# Altium schematic sheet Accelerometer.SchDoc: Accelerometer
size A; Author: Zac Carico; CompanyName: BYUI; DrawnBy: Zac Carico; Engineer: Zac Carico; Organization: CSEE; DocumentNumber: 12; Revision: 0.0.1; SheetNumber: 12; SheetTotal: 15
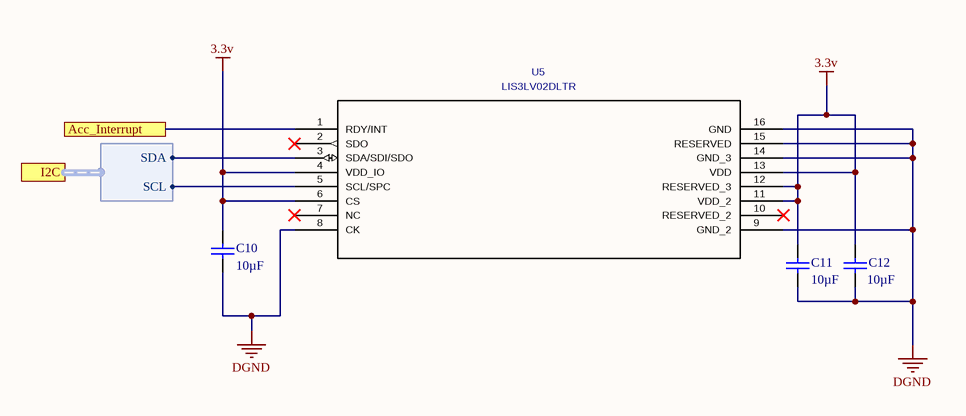
[diagram p0: Accelerometer.SchDoc]

## Parts
C10  Capacitance: 10µF  [CAPC1608X90X20LL10]  (hidden comment: C1608X5R1A106K080AC)
C11  Capacitance: 10µF  [CAPC1608X90X20LL10]  (hidden comment: C1608X5R1A106K080AC)
C12  Capacitance: 10µF  [CAPC1608X90X20LL10]  (hidden comment: C1608X5R1A106K080AC)
U5  LIS3LV02DLTR  [LGA-16_4P4X7P5X1]

## Ports
Acc_Interrupt, I2C (harness I2C)

## Harnesses
I2C: SCL, SDA

## Nets
3.3v: C10.2 C11.2 C12.2 U5.4(VDD_IO) U5.6(CS) U5.11(VDD_2) U5.12(RESERVED_3) U5.13(VDD)
DGND: C10.1 C11.1 C12.1 U5.8(CK) U5.9(GND_2) U5.14(GND_3) U5.15(RESERVED) U5.16(GND)
Acc_Interrupt: U5.1(RDY/INT) ; port Acc_Interrupt
NetU5_3: U5.3(SDA/SDI/SDO) ; port I2C.SDA
NetU5_5: U5.5(SCL/SPC) ; port I2C.SCL

Not connected (* = marked no-connect by the designer): U5 2(SDO)* 7(NC)* 10(RESERVED_2)*

## Library data of the parts
C10-C12 = CMP-2000-04979-1: Chip Capacitor, 10 uF, +/- 10%, 10 V, -55 to 85 degC, 0603 (1608 Metric), RoHS, Tape and Reel; PCN Part Number: MLCCPartNumberChange30/Nov/2012; Manufacturer: TDK; Temperature Coefficient: X5R; Product Training Modules: CSeriesGeneralApplicationsSEAT,CCV,andTVCLDesignToolsGuidetoReplacinganElectrolyticCapacitorwithanMLCC; Online Catalog: CSeries,GeneralPurpose; Voltage - Rated: 10V; Other Names: 445-7486-1; Design Resources: 20WNon-IsolatedBuckLEDDriverUsingPLLNK460KG; Kits: 445-9003-KIT-ND-KITCAPCERHICAPMLCCSMD; Height - Seated (Max): -; Family: CeramicCapacitors; Package Description: 2-Pin Surface Mount Device, Body 1.6 x 0.8 mm; Category: Capacitors; Datasheet Version: Mar-15; RoHS Information: RoHSCertificate-MLCC; Thickness (Max): 0.035"(0.90mm); Operating Temperature: -55degC~85degC; Package Reference: 603; Series: C; Applications: GeneralPurpose; Datasheet URL: http://download.siliconexpert.com/pdfs/2015/4/21/15/54/45/779/tdk_/manual/37024850441143360mlcc_commercial_general_en.pdf; Features: -; Lead Style: -; Lead Spacing: -; Ratings: -; Size / Dimension: 0.063"Lx0.031"W(1.60mmx0.80mm); Tolerance: ±10%; Mounting Type: SurfaceMount,MLCC; Standard Package: 1; Package / Case: 0603(1608Metric); Manufacturer URL: http://www.tdk.com/; Packaging: CutTape(CT); Manufacturer Part Number: C1608X5R1A106K080AC
U5 = LIS3LV02DLTR: ACCELEROMETER 2-6G I2C/SPI 16LGA; C: Copyright (C) 2015 Accelerated Designs. All rights reserved; Vendor: STMicroelectronics; Built_By: EMA_UL_Team; Value: LIS3LV02DLTR; Manufacturer_Part_Number: LIS3LV02DLTR